# Altium schematic sheet 1_Rotary_Encoder_Input_output.SchDoc
size A4; SheetNumber: 2; SheetTotal: 4
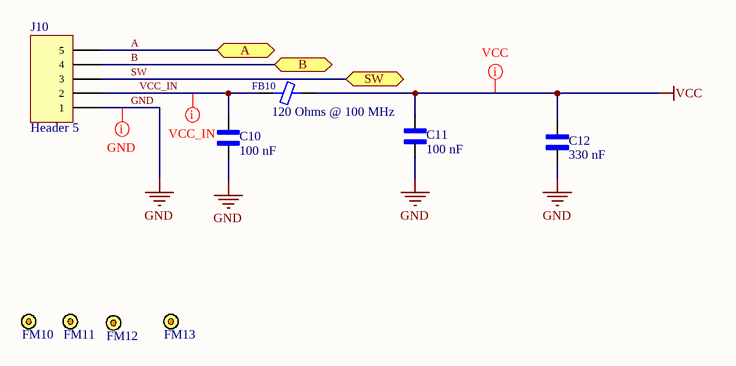
[diagram p0: 1_Rotary_Encoder_Input_output.SchDoc]

## Parts
C10  100 nF  [C-0603]
C11  100 nF  [C-0603]
C12  330 nF  [C-0603]
FB10  120 Ohms @ 100 MHz  [FER 0603_1608]
FM10  FM  [Fiducial_Marker_1mm]  (value not drawn)
FM11  FM  [Fiducial_Marker_1mm]  (value not drawn)
FM12  FM  [Fiducial_Marker_1mm]  (value not drawn)
FM13  FM  [Fiducial_Marker_1mm]  (value not drawn)
J10  Header 5  [HDR1X5]

## Ports
A (bidir), B (bidir), SW (bidir)

## Nets
GND: C10.1 C11.1 C12.1 J10.1
VCC: C11.2 C12.2 FB10.2
A: J10.5 ; port A
B: J10.4 ; port B
SW: J10.3 ; port SW
VCC_IN: C10.2 FB10.1 J10.2

## Layout directives
net class Power: VCC, VCC_IN
net class GND: GND

## Library data of the parts
C10-C12 = C-0603: Ceramic Capacitor 16V 0603 (1608 Metric); MP: C0603C104J4RAC; MF: KEMET; SnapEDA_Link: https://www.snapeda.com/parts/C0603C104J4RAC/KEMET/view-part/1763758/?ref=snap; Availability: Warning; Package: 0603 KEMET; Check_prices: https://www.snapeda.com/parts/C0603C104J4RAC/KEMET/view-part/1763758/?ref=eda; Value: *; Price: None
FB10 = PE-0603PFB121ST: FERRITE BEAD 120 OHM 0603 1LN; Manufacturer: Pulse Electronics Network; Current Rating (Max): 2A; DC Resistance (DCR) (Max): 50mOhm; Filter Type: Power Line; Number of Lines: 1; XjtagCategorisation: Ferrite Bead.pdd; Part Number: PE-0603PFB121ST; ComponentLink1Description: Datasheet; ComponentLink1URL: https://productfinder.pulseeng.com/doc_type/WEB301/doc_num/WC706/doc_part/WC706.pdf; ComponentLink2Description: DigiKey Link; ComponentLink2URL: https://www.digikey.com/en/products/detail/pulse-electronics-network/PE-0603PFB121ST/5050544; Device Package: 0603 (1608 Metric); Height (Max): 0.041" (1.05mm); Impedance @ Frequency: 120 Ohms @ 100 MHz; LastUpdated: 19-09-2022 13:44:01; Lifecycle Status: Active; Minimum Order: 1; Mounting Type: Surface Mount; Operating Temperature: -40°C ~ 105°C; Package / Case: 0603 (1608 Metric); Packaging: TapeAndReel; PartId: 591; Part Status: Active; Price: 0.01; Series: PFB; Size / Dimension: 0.063" L x 0.032" W (1.60mm x 0.80mm); Supplier 1: DigiKey; Supplier Part Number 1: 553-2387-6-ND; Value: 120 Ohms @ 100 MHz
FM10-FM13 = Fiducial Marker
J10 = Header 5: Header, 5-Pin; LatestRevisionDate: 17-Jul-2002; LatestRevisionNote: Re-released for DXP Platform.; Publisher: Altium Limited